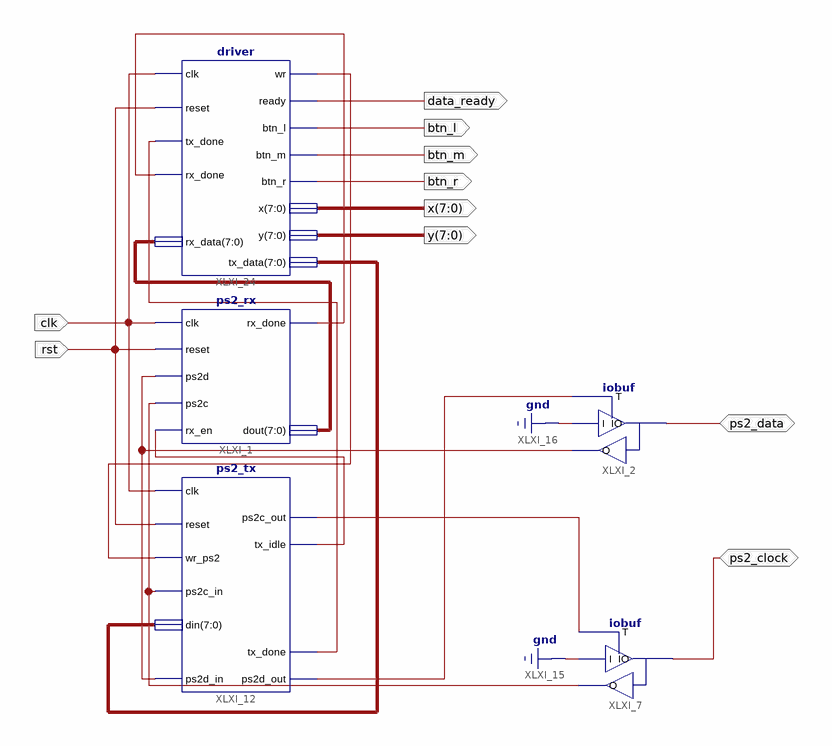
[diagram p0: schematic sheet 1]
// Xilinx ISE schematic main.sch (spartan3e) as structural Verilog: 5 symbols, 10 ports
module main (
  input  clk,
  input  rst,
  inout  ps2_data,
  inout  ps2_clock,
  output [7:0] x,
  output [7:0] y,
  output btn_r,
  output btn_m,
  output btn_l,
  output data_ready
);

  wire XLXN_7, XLXN_8, XLXN_32, XLXN_34, XLXN_38, XLXN_49, XLXN_52, XLXN_53;
  wire [7:0] XLXN_56, XLXN_57;

  ps2_rx XLXI_1 (
    .clk(clk), .reset(rst), .ps2d(XLXN_7), .ps2c(XLXN_8), .rx_en(XLXN_34), .rx_done(XLXN_52), .dout(XLXN_56));
  iobuf XLXI_2 (.I(1'b0), .IO(ps2_data), .O(XLXN_7), .T(XLXN_38));
  iobuf XLXI_7 (.I(1'b0), .IO(ps2_clock), .O(XLXN_8), .T(XLXN_32));
  ps2_tx XLXI_12 (
    .clk(clk), .reset(rst), .wr_ps2(XLXN_49), .ps2c_in(XLXN_8), .din(XLXN_57), .ps2c_out(XLXN_32),
    .tx_idle(XLXN_34), .tx_done(XLXN_53), .ps2d_in(XLXN_7), .ps2d_out(XLXN_38));
  driver XLXI_24 (
    .clk(clk), .reset(rst), .tx_done(XLXN_53), .rx_done(XLXN_52), .rx_data(XLXN_56), .wr(XLXN_49),
    .ready(data_ready), .btn_l(btn_l), .btn_m(btn_m), .btn_r(btn_r), .x(x), .y(y), .tx_data(XLXN_57));
endmodule
